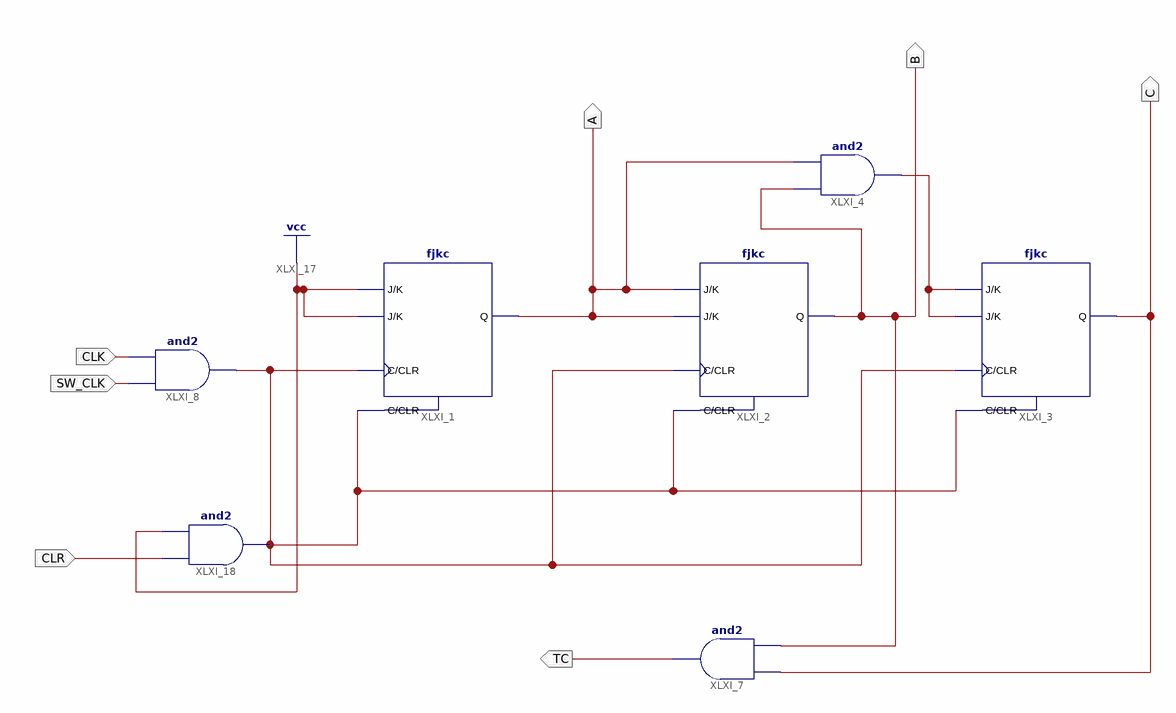
[diagram p0: schematic sheet 1]
// Xilinx ISE schematic SyncCounter1_6.sch (spartan6) as structural Verilog: 7 symbols, 7 ports
module SyncCounter1_6 (
  input  SW_CLK,
  input  CLK,
  input  CLR,
  output TC,
  output A,
  output C,
  output B
);

  wire XLXN_8;

  fjkc XLXI_1 (.C(TC), .CLR(TC), .J(1'b1), .K(1'b1), .Q(A));
  fjkc XLXI_2 (.C(TC), .CLR(TC), .J(A), .K(A), .Q(B));
  fjkc XLXI_3 (.C(TC), .CLR(TC), .J(XLXN_8), .K(XLXN_8), .Q(C));
  and XLXI_4 (XLXN_8, B, A);
  and XLXI_7 (TC, B, C);
  and XLXI_8 (TC, SW_CLK, CLK);
  and XLXI_18 (TC, CLR, 1'b1);
endmodule
